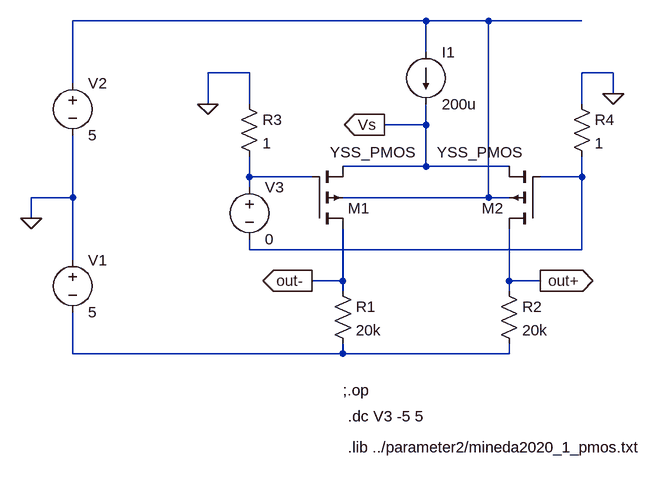
[diagram p0: schematic diffamp_test10um.asc]
diffamp_test10um.asc, the LTspice schematic file:
Version 4
SHEET 1 1536 2968
WIRE 32 -192 -512 -192
WIRE 128 -192 32 -192
WIRE 272 -192 128 -192
WIRE 32 -144 32 -192
WIRE -240 -112 -304 -112
WIRE 320 -112 272 -112
WIRE -512 -96 -512 -192
WIRE 320 -80 320 -112
WIRE -304 -64 -304 -112
WIRE -240 -64 -240 -112
WIRE 272 -64 272 -112
WIRE 32 -32 32 -64
WIRE 32 -32 -32 -32
WIRE 32 32 32 -32
WIRE 32 32 -96 32
WIRE 160 32 32 32
WIRE -240 48 -240 16
WIRE -144 48 -240 48
WIRE 272 48 272 16
WIRE 272 48 208 48
WIRE -240 64 -240 48
WIRE -512 80 -512 -16
WIRE -512 80 -576 80
WIRE 128 80 128 -192
WIRE 128 80 -96 80
WIRE 160 80 128 80
WIRE -576 112 -576 80
WIRE -240 160 -240 144
WIRE 272 160 272 48
WIRE 272 160 -240 160
WIRE -512 176 -512 80
WIRE -96 208 -96 128
WIRE -96 208 -144 208
WIRE 160 208 160 128
WIRE 208 208 160 208
WIRE -96 224 -96 208
WIRE 160 224 160 208
WIRE -512 320 -512 256
WIRE -96 320 -96 304
WIRE -96 320 -512 320
WIRE 160 320 160 304
WIRE 160 320 -96 320
FLAG -304 -64 0
FLAG 320 -80 0
FLAG -576 112 0
FLAG -144 208 out-
IOPIN -144 208 Out
FLAG 208 208 out+
IOPIN 208 208 Out
FLAG -32 -32 Vs
IOPIN -32 -32 Out
SYMBOL voltage -512 160 R0
WINDOW 123 0 0 Left 2
WINDOW 39 0 0 Left 2
SYMATTR InstName V1
SYMATTR Value 5
SYMBOL pmos4 208 128 R180
WINDOW 3 28 118 Left 2
SYMATTR Value YSS_PMOS
SYMATTR InstName M2
SYMATTR Value2 l=10u w=100u
SYMBOL voltage -240 48 R0
WINDOW 123 24 124 Left 2
WINDOW 39 0 0 Left 2
SYMATTR InstName V3
SYMATTR Value 0
SYMBOL pmos4 -144 128 M180
WINDOW 3 28 118 Left 2
SYMATTR Value YSS_PMOS
SYMATTR InstName M1
SYMATTR Value2 l=10u w=100u
SYMBOL voltage -512 -112 R0
WINDOW 123 0 0 Left 2
WINDOW 39 0 0 Left 2
SYMATTR InstName V2
SYMATTR Value 5
SYMBOL res -112 208 R0
SYMATTR InstName R1
SYMATTR Value 20k
SYMBOL res 144 208 R0
SYMATTR InstName R2
SYMATTR Value 20k
SYMBOL current 32 -144 R0
WINDOW 123 0 0 Left 2
WINDOW 39 0 0 Left 2
SYMATTR InstName I1
SYMATTR Value 200u
SYMBOL res -256 -80 R0
SYMATTR InstName R3
SYMATTR Value 1
SYMBOL res 256 -80 R0
SYMATTR InstName R4
SYMATTR Value 1
TEXT -88 416 Left 2 !.dc V3 -5 5
TEXT -88 464 Left 2 !.lib ../parameter2/mineda2020_1_pmos.txt
TEXT -96 376 Left 2 !;.op

The netlist it stands for:
* diffamp_test10um.asc
V1 0 N004 5
M2 out+ N003 Vs N001 YSS_PMOS l=10u w=100u
V3 N002 N003 0
M1 out- N002 Vs N001 YSS_PMOS l=10u w=100u
V2 N001 0 5
R1 out- N004 20k
R2 out+ N004 20k
I1 N001 Vs 200u
R3 0 N002 1
R4 0 N003 1
.model NMOS NMOS
.model PMOS PMOS
.lib standard.mos
.dc V3 -5 5
.lib ../parameter2/mineda2020_1_pmos.txt
;.op
.backanno
.end

* Results of the author's LTspice run, read from the files saved beside the schematic
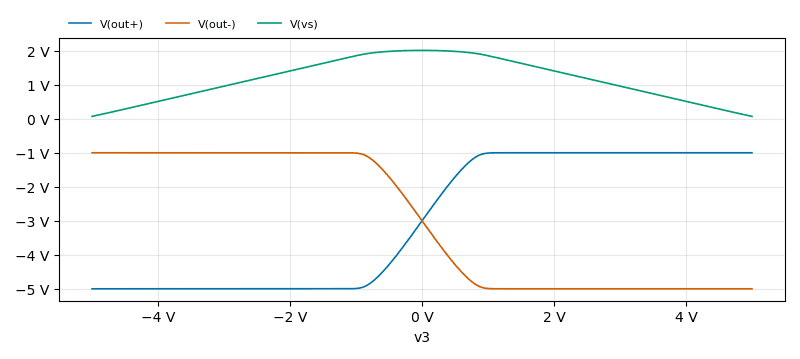
[diagram p1: DC transfer characteristic of diffamp_test10um.asc, plotted from the saved traces]
* DC transfer characteristic, 1 run:
*   V(out+): -5 V at v3=-5 V, -1 V at v3=5 V, min -5 V, max -1 V
*   V(out-): -1 V at v3=-5 V, -5 V at v3=5 V, min -5 V, max -1 V
*   V(vs): 70.03 mV at v3=-5 V, 70.03 mV at v3=5 V, min 70.03 mV, max 2.011 V